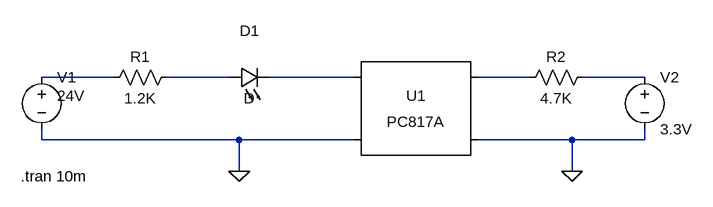
[diagram p0: schematic Draft1.asc]
Draft1.asc, the LTspice schematic file:
Version 4.1
SHEET 1 1448 680
WIRE -32 128 -144 128
WIRE 144 128 48 128
WIRE 336 128 208 128
WIRE 608 128 528 128
WIRE 784 128 688 128
WIRE -144 224 -144 208
WIRE 160 224 -144 224
WIRE 336 224 160 224
WIRE 672 224 528 224
WIRE 784 224 784 208
WIRE 784 224 672 224
WIRE 160 272 160 224
WIRE 672 272 672 224
FLAG 160 272 0
FLAG 672 272 0
SYMBOL voltage -144 112 R0
WINDOW 3 24 44 Left 2
WINDOW 123 0 0 Left 0
WINDOW 39 0 0 Left 0
SYMATTR InstName V1
SYMATTR Value 24V
SYMBOL voltage 784 112 R0
SYMATTR InstName V2
SYMATTR Value 3.3V
SYMBOL res 64 112 R90
WINDOW 0 0 56 VBottom 2
WINDOW 3 32 56 VTop 2
SYMATTR InstName R1
SYMATTR Value 1.2K
SYMBOL res 704 112 R90
WINDOW 0 0 56 VBottom 2
WINDOW 3 32 56 VTop 2
SYMATTR InstName R2
SYMATTR Value 4.7K
SYMBOL LED 144 144 R270
WINDOW 0 72 32 VTop 2
WINDOW 3 0 32 VBottom 2
SYMATTR InstName D1
SYMBOL Optos\\PC817A 432 176 R0
SYMATTR InstName U1
TEXT -176 280 Left 2 !.tran 10m

The netlist it stands for:
* Draft1.asc
V1 N001 0 24V
V2 N005 0 3.3V
R1 N002 N001 1.2K
R2 N005 N004 4.7K
D1 N002 N003 D
X§U1 N003 0 N004 0 PC817 Igain=1m
.model D D
.lib standard.dio
.tran 10m
.lib PC817.sub
.backanno
.end